# Altium schematic sheet BumpSensors.SchDoc
size A
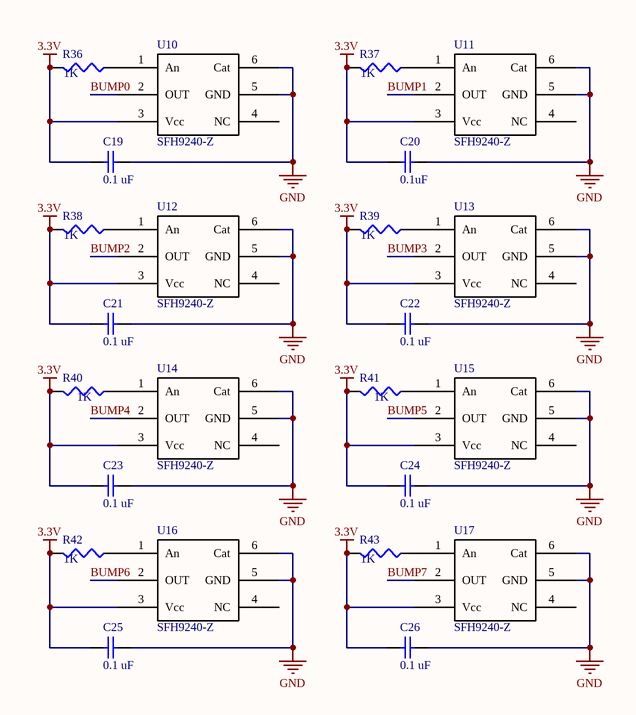
[diagram p0: BumpSensors.SchDoc]

## Parts
C19  value 0.1 uF  [CAPC1005L]  (hidden comment: Cap Semi)
C20  value 0.1uF  [CAPC1005L]  (hidden comment: Cap Semi)
C21  value 0.1 uF  [CAPC1005L]  (hidden comment: Cap Semi)
C22  value 0.1 uF  [CAPC1005L]  (hidden comment: Cap Semi)
C23  value 0.1 uF  [CAPC1005L]  (hidden comment: Cap Semi)
C24  value 0.1 uF  [CAPC1005L]  (hidden comment: Cap Semi)
C25  value 0.1 uF  [CAPC1005L]  (hidden comment: Cap Semi)
C26  value 0.1 uF  [CAPC1005L]  (hidden comment: Cap Semi)
R36  value 1K  [RESC1608L]  (hidden comment: Res3)
R37  value 1K  [RESC1608L]  (hidden comment: Res3)
R38  value 1K  [RESC1608L]  (hidden comment: Res3)
R39  value 1K  [RESC1608L]  (hidden comment: Res3)
R40  value 1K  [RESC1608L]  (hidden comment: Res3)
R41  value 1K  [RESC1608L]  (hidden comment: Res3)
R42  value 1K  [RESC1608L]  (hidden comment: Res3)
R43  value 1K  [RESC1608L]  (hidden comment: Res3)
U10  SFH9240-Z  [SFH9240-Z]
U11  SFH9240-Z  [SFH9240-Z]
U12  SFH9240-Z  [SFH9240-Z]
U13  SFH9240-Z  [SFH9240-Z]
U14  SFH9240-Z  [SFH9240-Z]
U15  SFH9240-Z  [SFH9240-Z]
U16  SFH9240-Z  [SFH9240-Z]
U17  SFH9240-Z  [SFH9240-Z]

## Nets
3.3V: C19.2 C20.2 C21.2 C22.2 C23.2 C24.2 C25.2 C26.2 R36.2 R37.2 R38.2 R39.2 R40.2 R41.2 R42.2 R43.2 U10.3(Vcc) U11.3(Vcc) U12.3(Vcc) U13.3(Vcc) U14.3(Vcc) U15.3(Vcc) U16.3(Vcc) U17.3(Vcc)
GND: C19.1 C20.1 C21.1 C22.1 C23.1 C24.1 C25.1 C26.1 U10.5(GND) U10.6(Cat) U11.5(GND) U11.6(Cat) U12.5(GND) U12.6(Cat) U13.5(GND) U13.6(Cat) U14.5(GND) U14.6(Cat) U15.5(GND) U15.6(Cat) U16.5(GND) U16.6(Cat) U17.5(GND) U17.6(Cat)
BUMP0: U10.2(OUT)
BUMP1: U11.2(OUT)
BUMP2: U12.2(OUT)
BUMP3: U13.2(OUT)
BUMP4: U14.2(OUT)
BUMP5: U15.2(OUT)
BUMP6: U16.2(OUT)
BUMP7: U17.2(OUT)
NetR36_1: R36.1 U10.1(An)
NetR37_1: R37.1 U11.1(An)
NetR38_1: R38.1 U12.1(An)
NetR39_1: R39.1 U13.1(An)
NetR40_1: R40.1 U14.1(An)
NetR41_1: R41.1 U15.1(An)
NetR42_1: R42.1 U16.1(An)
NetR43_1: R43.1 U17.1(An)

Not connected (* = marked no-connect by the designer): U10 4(NC); U11 4(NC); U12 4(NC); U13 4(NC); U14 4(NC); U15 4(NC); U16 4(NC); U17 4(NC)

## Library data of the parts
C19-C26 = Cap Semi: Capacitor (Semiconductor SIM Model); Published: 8-Jun-2000; LatestRevisionDate: 29-May-2009; LatestRevisionNote: IPC-7351 Footprint Added.; PackageReference: C1206; Publisher: Altium Limited; PackageDescription: Chip Capacitor
R36-R43 = Res3: Resistor; Published: 8-Jun-2000; LatestRevisionDate: 29-May-2009; LatestRevisionNote: IPC-7351 Footprint Added.; PackageReference: J1-0603; Publisher: Altium Limited; PackageDescription: Chip Resistor